# EasyEDA schematic schematic Easy EDA project.json
TITLE: Sheet_1; REV: 1.0; Date: 2019-07-18; Sheet: 1/1; Drawn By: lgd.mrk; Company: Lagodych Mark
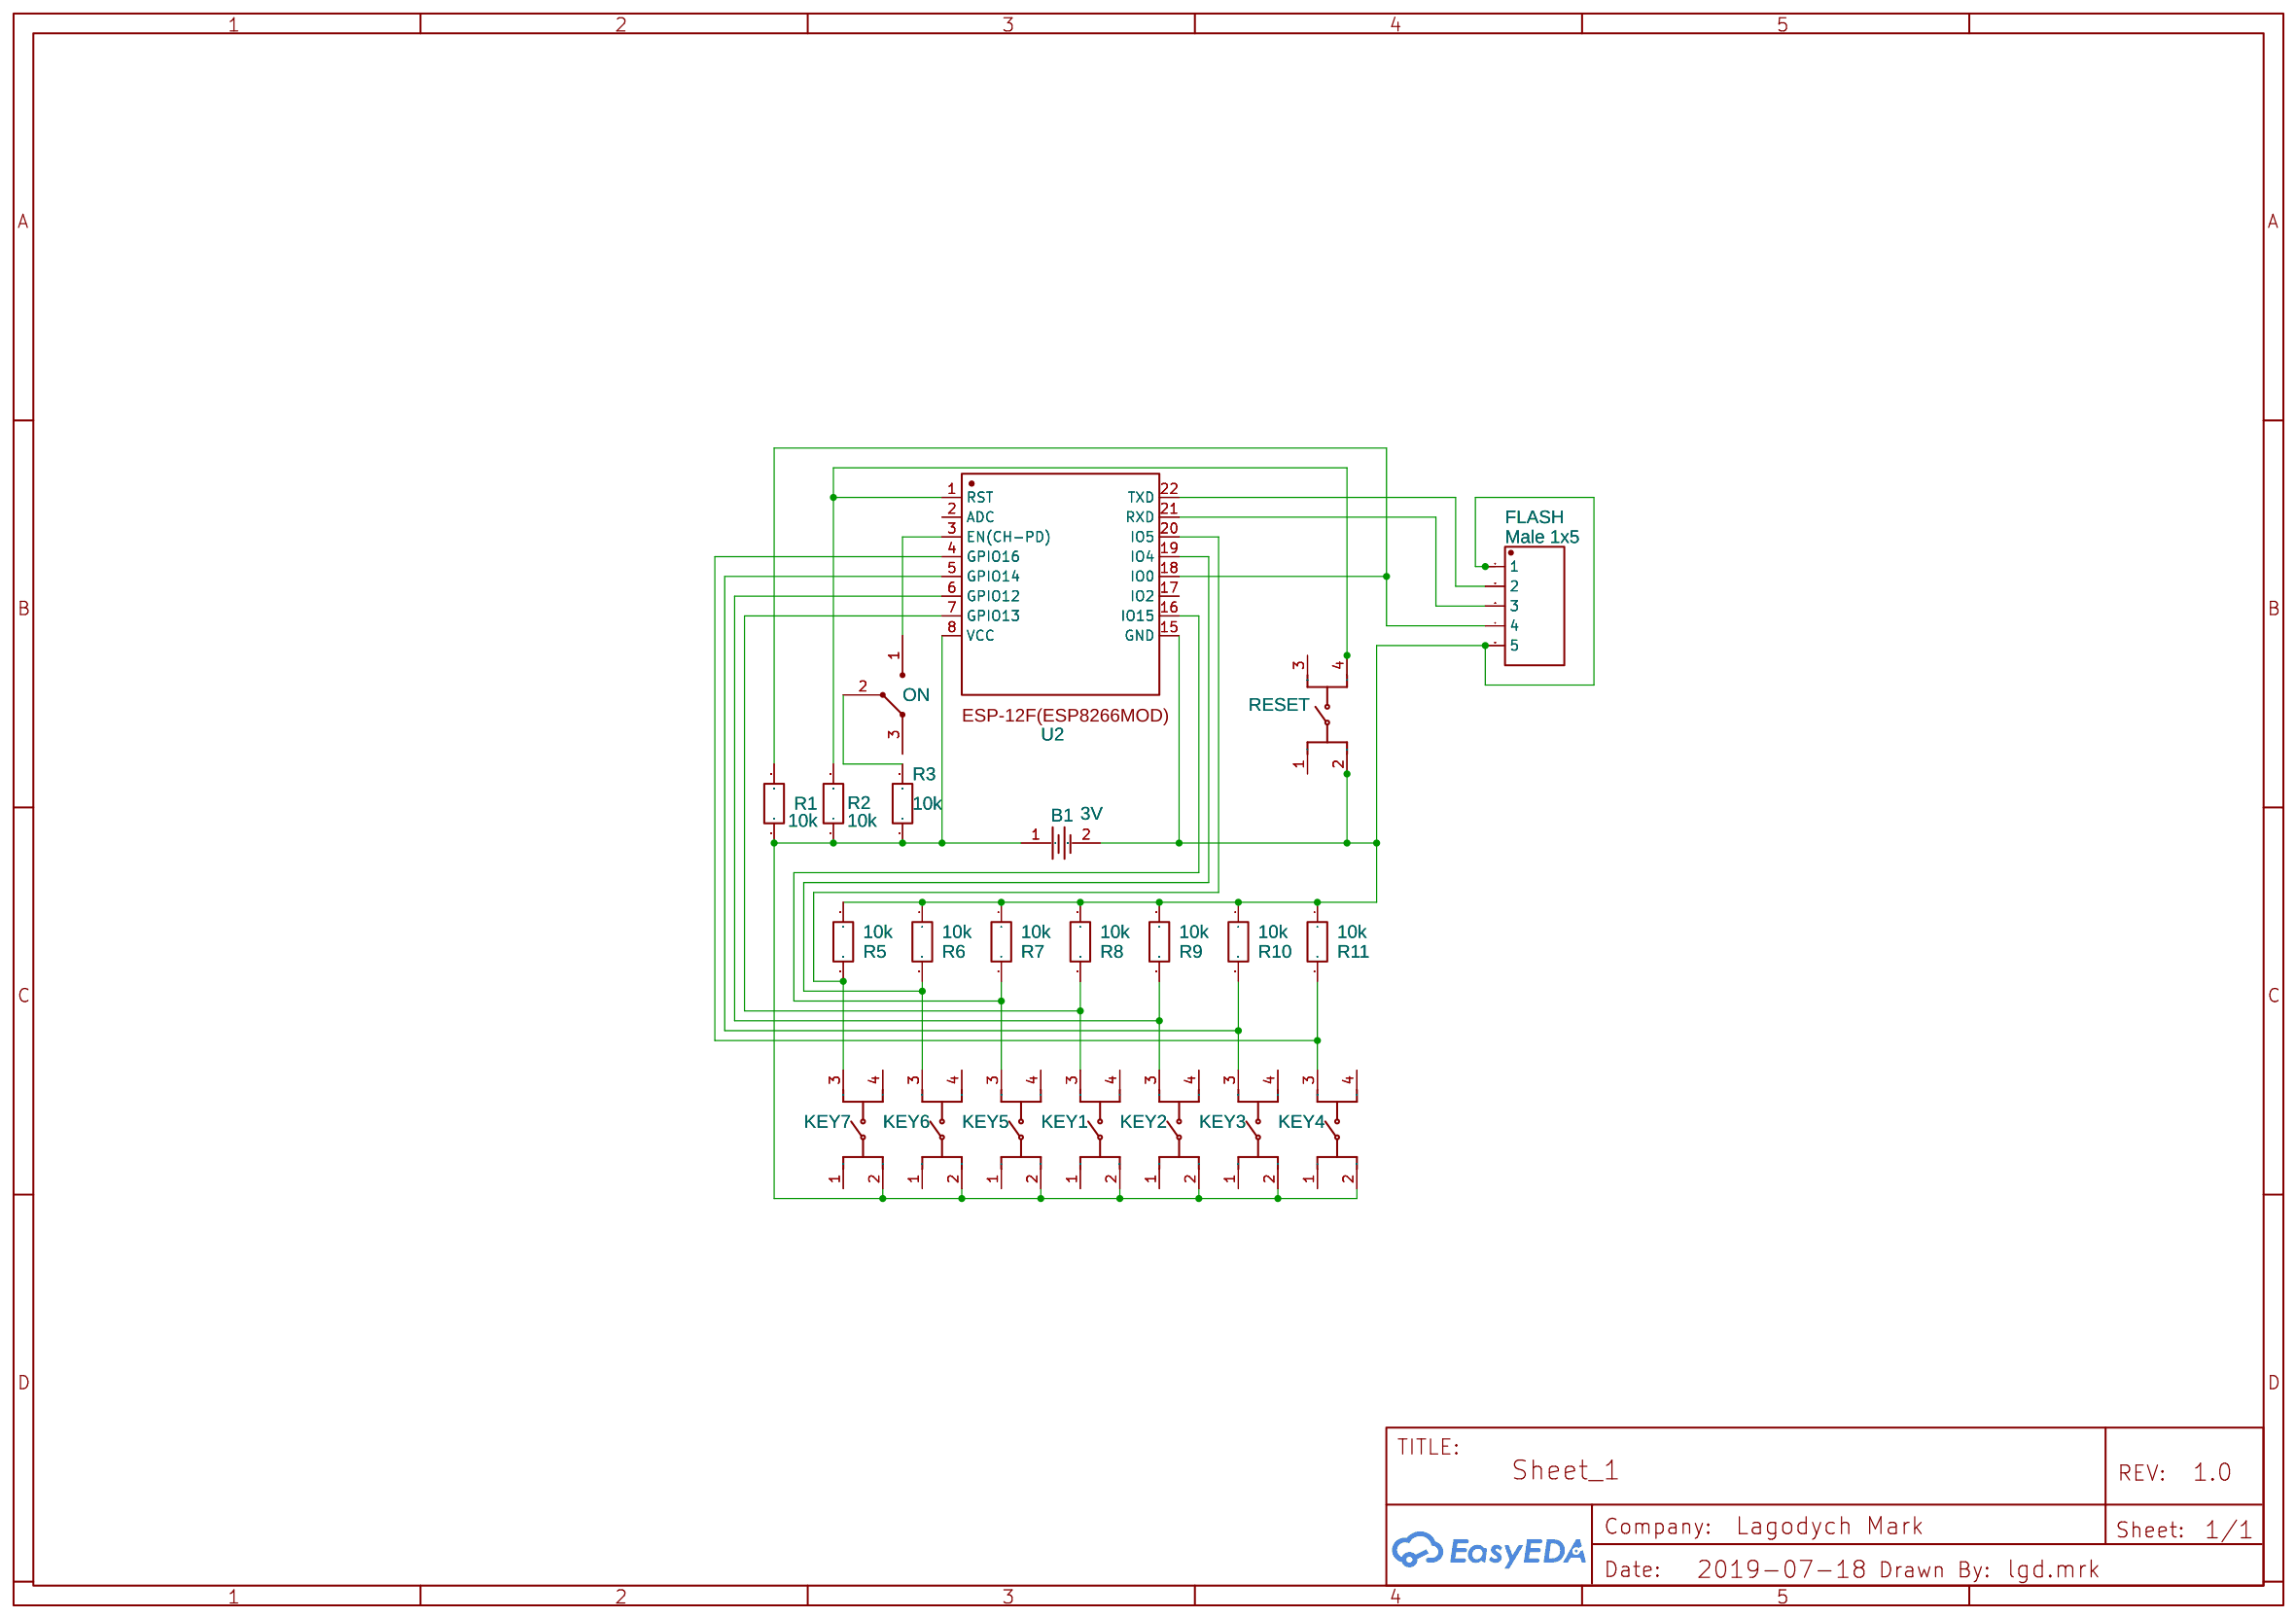
[diagram p0: schematic sheet]

## Parts
B1  3V  [BATTERY-1]
FLASH  Male 1x5  [DIP-1X5P-2.54MM-M]
KEY1  TS-1102-5016  [KEY-6.0*6.0-2]
KEY2  TS-1102-5016  [KEY-6.0*6.0-2]
KEY3  TS-1102-5016  [KEY-6.0*6.0-2]
KEY4  TS-1102-5016  [KEY-6.0*6.0-2]
KEY5  TS-1102-5016  [KEY-6.0*6.0-2]
KEY6  TS-1102-5016  [KEY-6.0*6.0-2]
KEY7  TS-1102-5016  [KEY-6.0*6.0-2]
ON  SIMPLE SWITCH  [SWITCH_12F14]
R1  10k  [AXIAL-0.3]
R2  10k  [AXIAL-0.3]
R3  10k  [AXIAL-0.3]
R5  10k  [AXIAL-0.3]
R6  10k  [AXIAL-0.3]
R7  10k  [AXIAL-0.3]
R8  10k  [AXIAL-0.3]
R9  10k  [AXIAL-0.3]
R10  10k  [AXIAL-0.3]
R11  10k  [AXIAL-0.3]
RESET  TS-1102-5016  [KEY-6.0*6.0-2]
U2  esp8266-12  [ESP8266-12]

## Library data of the parts
B1 = -: Supplier: LCSC; Manufacturer: Q&J; Manufacturer Part: BS-2-1; image: //image.lceda.cn/szlcsc/C70376.jpg; Supplier Part: C70376; Package Display: No
FLASH = -: Supplier: LCSC; Manufacturer: Ckmtw; Manufacturer Part: 210S-1*5P L=11.6MMGold-plated black; Contributor: LCSC; Supplier Part: C124379
KEY1-KEY7 RESET = -: Supplier: LCSC; Manufacturer: SOFNG; Contributor: EasyEDA; Supplier Part: C111609
ON = -: Contributor: olivier n
R1-R3 R5-R11 = Res_AXIAL-0.3(1/8W)_EU: Manufacturer Part: ?
U2 = -: Manufacturer Part: New SchematicLib; Contributor: dnk1777

## Nets
Net-(B1-1): B1.1 KEY1.2 KEY2.2 KEY3.2 KEY4.2 KEY5.2 KEY6.2 KEY7.2 R1.1 R2.1 R3.1 U2.8(VCC)
Net-(B1-2): B1.2 FLASH.1 FLASH.5 R5.1 R6.1 R7.1 R8.1 R9.1 R10.1 R11.1 RESET.2 U2.15(GND)
Net-(FLASH-2): FLASH.2 U2.22(TXD)
Net-(FLASH-3): FLASH.3 U2.21(RXD)
Net-(FLASH-4): FLASH.4 R1.2 U2.18(IO0)
Net-(KEY1-3): KEY1.3 R8.2 U2.7(GPIO13)
Net-(KEY2-3): KEY2.3 R9.2 U2.6(GPIO12)
Net-(KEY3-3): KEY3.3 R10.2 U2.5(GPIO14)
Net-(KEY4-3): KEY4.3 R11.2 U2.4(GPIO16)
Net-(KEY5-3): KEY5.3 R7.2 U2.16(IO15)
Net-(KEY6-3): KEY6.3 R6.2 U2.19(IO4)
Net-(KEY7-3): KEY7.3 R5.2 U2.20(IO5)
Net-(ON-1): ON.1 U2.3(EN(CH-PD))
Net-(ON-2): ON.2 R3.2
Net-(R2-2): R2.2 RESET.4 U2.1(RST)

Not connected (* = marked no-connect by the designer): KEY1 1 4; KEY2 1 4; KEY3 1 4; KEY4 1 4; KEY5 1 4; KEY6 1 4; KEY7 1 4; ON 3; RESET 1 3; U2 2(ADC) 17(IO2)
